# EAGLE design tivaAdapterPcb (EAGLE 9.5.2)
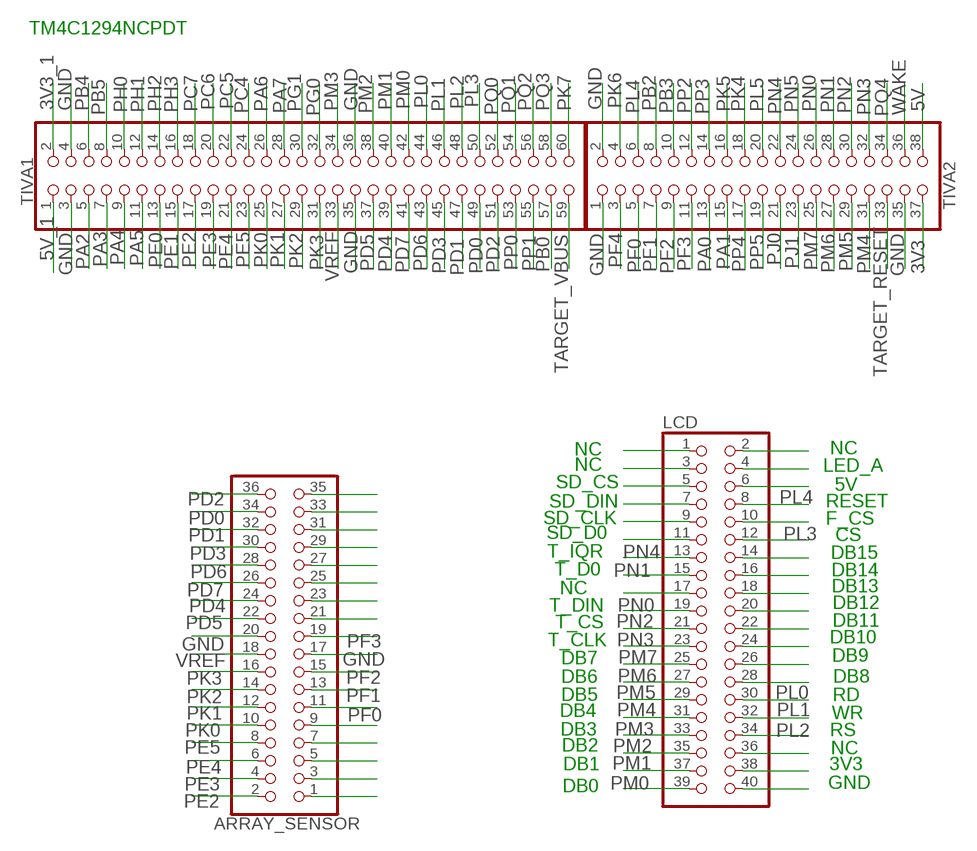
[diagram p0: schematic, sheet 1]

## Parts
ARRAY_SENSOR  PINHD-2X18  [2X18]
LCD  PINHD-2X20  [2X20]
TIVA1  PINHD-2X30  [2X30]
TIVA2  PINHD-2X19  [2X19]

## Nets
3V3: TIVA2.37
3V3_1: TIVA1.2
5V: TIVA2.38
5V_1: TIVA1.1
GND: ARRAY_SENSOR.17 ARRAY_SENSOR.20 TIVA1.3 TIVA1.4 TIVA1.35 TIVA1.36 TIVA2.1 TIVA2.2 TIVA2.35
N$1: ARRAY_SENSOR.1
N$2: LCD.1
N$3: ARRAY_SENSOR.3
N$4: LCD.2
N$5: ARRAY_SENSOR.5
N$6: LCD.3
N$7: ARRAY_SENSOR.7
N$8: LCD.4
N$9: ARRAY_SENSOR.9
N$10: LCD.5
N$11: LCD.6
N$12: LCD.7
N$14: LCD.9
N$15: LCD.10
N$16: LCD.11
N$19: LCD.14
N$21: ARRAY_SENSOR.21
N$22: LCD.16
N$23: ARRAY_SENSOR.23
N$24: LCD.17
N$25: ARRAY_SENSOR.25
N$26: LCD.18
N$27: ARRAY_SENSOR.27
N$29: ARRAY_SENSOR.29
N$30: LCD.20
N$31: ARRAY_SENSOR.31
N$33: ARRAY_SENSOR.33
N$34: LCD.22
N$35: ARRAY_SENSOR.35
N$37: LCD.24
N$39: LCD.26
N$41: LCD.28
N$49: LCD.36
N$51: LCD.38
N$53: LCD.40
PA0: TIVA2.13
PA1: TIVA2.15
PA2: TIVA1.5
PA3: TIVA1.7
PA4: TIVA1.9
PA5: TIVA1.11
PA6: TIVA1.26
PA7: TIVA1.28
PB0: TIVA1.57
PB2: TIVA2.8
PB3: TIVA2.10
PB4: TIVA1.6
PB5: TIVA1.8
PC4: TIVA1.24
PC5: TIVA1.22
PC6: TIVA1.20
PC7: TIVA1.18
PD0: ARRAY_SENSOR.34 TIVA1.49
PD1: ARRAY_SENSOR.32 TIVA1.47
PD2: ARRAY_SENSOR.36 TIVA1.51
PD3: ARRAY_SENSOR.30 TIVA1.45
PD4: ARRAY_SENSOR.24 TIVA1.39
PD5: ARRAY_SENSOR.22 TIVA1.37
PD6: ARRAY_SENSOR.28 TIVA1.43
PD7: ARRAY_SENSOR.26 TIVA1.41
PE0: TIVA1.13
PE1: TIVA1.15
PE2: ARRAY_SENSOR.2 TIVA1.17
PE3: ARRAY_SENSOR.4 TIVA1.19
PE4: ARRAY_SENSOR.6 TIVA1.21
PE5: ARRAY_SENSOR.8 TIVA1.23
PF0: ARRAY_SENSOR.11 TIVA2.5
PF1: ARRAY_SENSOR.13 TIVA2.7
PF2: ARRAY_SENSOR.15 TIVA2.9
PF3: ARRAY_SENSOR.19 TIVA2.11
PF4: TIVA2.3
PG0: TIVA1.32
PG1: TIVA1.30
PH0: TIVA1.10
PH1: TIVA1.12
PH2: TIVA1.14
PH3: TIVA1.16
PJ0: TIVA2.21
PJ1: TIVA2.23
PK0: ARRAY_SENSOR.10 TIVA1.25
PK1: ARRAY_SENSOR.12 TIVA1.27
PK2: ARRAY_SENSOR.14 TIVA1.29
PK3: ARRAY_SENSOR.16 TIVA1.31
PK4: TIVA2.18
PK5: TIVA2.16
PK6: TIVA2.4
PK7: TIVA1.60
PL0: LCD.30 TIVA1.44
PL1: LCD.32 TIVA1.46
PL2: LCD.34 TIVA1.48
PL3: LCD.12 TIVA1.50
PL4: LCD.8 TIVA2.6
PL5: TIVA2.20
PM0: LCD.39 TIVA1.42
PM1: LCD.37 TIVA1.40
PM2: LCD.35 TIVA1.38
PM3: LCD.33 TIVA1.34
PM4: LCD.31 TIVA2.31
PM5: LCD.29 TIVA2.29
PM6: LCD.27 TIVA2.27
PM7: LCD.25 TIVA2.25
PN0: LCD.19 TIVA2.26
PN1: LCD.15 TIVA2.28
PN2: LCD.21 TIVA2.30
PN3: LCD.23 TIVA2.32
PN4: LCD.13 TIVA2.22
PN5: TIVA2.24
PP0: TIVA1.53
PP1: TIVA1.55
PP2: TIVA2.12
PP3: TIVA2.14
PP4: TIVA2.17
PP5: TIVA2.19
PQ0: TIVA1.52
PQ1: TIVA1.54
PQ2: TIVA1.56
PQ3: TIVA1.58
PQ4: TIVA2.34
TARGET_RESET: TIVA2.33
TARGET_VBUS: TIVA1.59
VREF: ARRAY_SENSOR.18 TIVA1.33
WAKE: TIVA2.36

## Notes on the sheet
- TM4C1294NCPDT
- NC | NC
- NC | LED_A
- SD_CS | 5V
- SD_DIN | RESET
- SD_CLK | F_CS
- SD_D0 | CS
- T_IQR | DB15
- T_D0 | DB14
- NC | DB13
- T_DIN | DB12
- T_CS | DB11
- T_CLK | DB10
- DB7 | DB9
- DB6 | DB8
- DB5 | RD
- DB4 | WR
- DB3 | RS
- DB2 | NC
- DB1 | 3V3
- DB0 | GND

## Library data of the parts
ARRAY_SENSOR = pinhead:PINHD-2X18: PIN HEADER
LCD = pinhead:PINHD-2X20: PIN HEADER
TIVA1 = pinhead:PINHD-2X30: PIN HEADER
TIVA2 = pinhead:PINHD-2X19: PIN HEADER

## Board
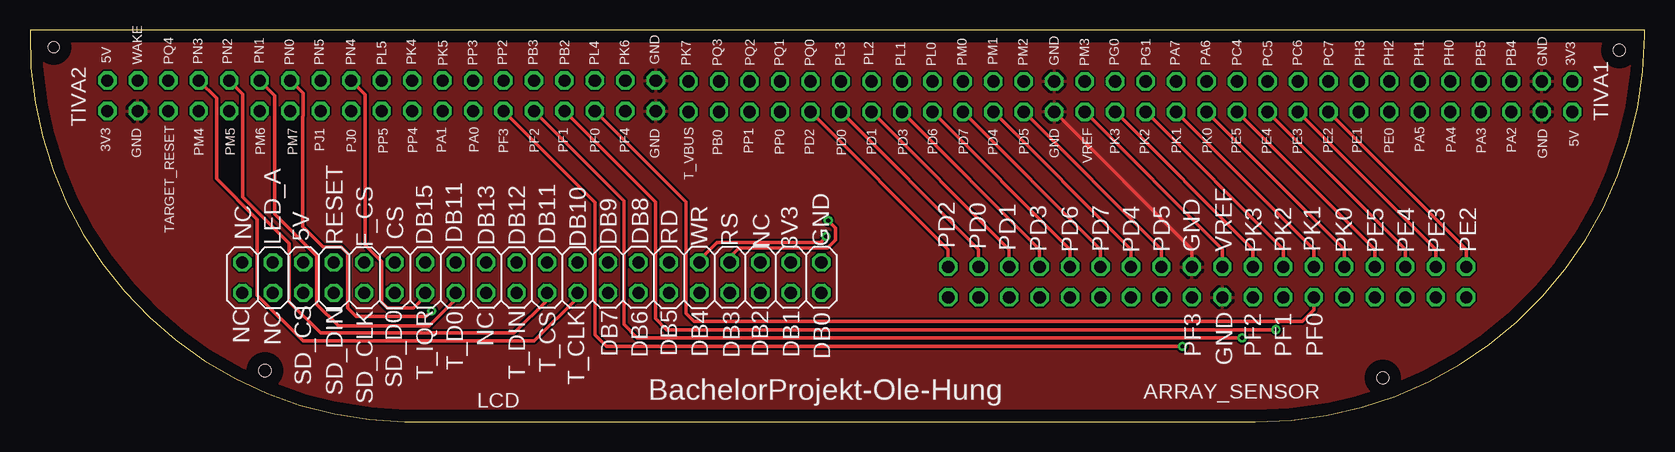
[diagram p1: board, top side]
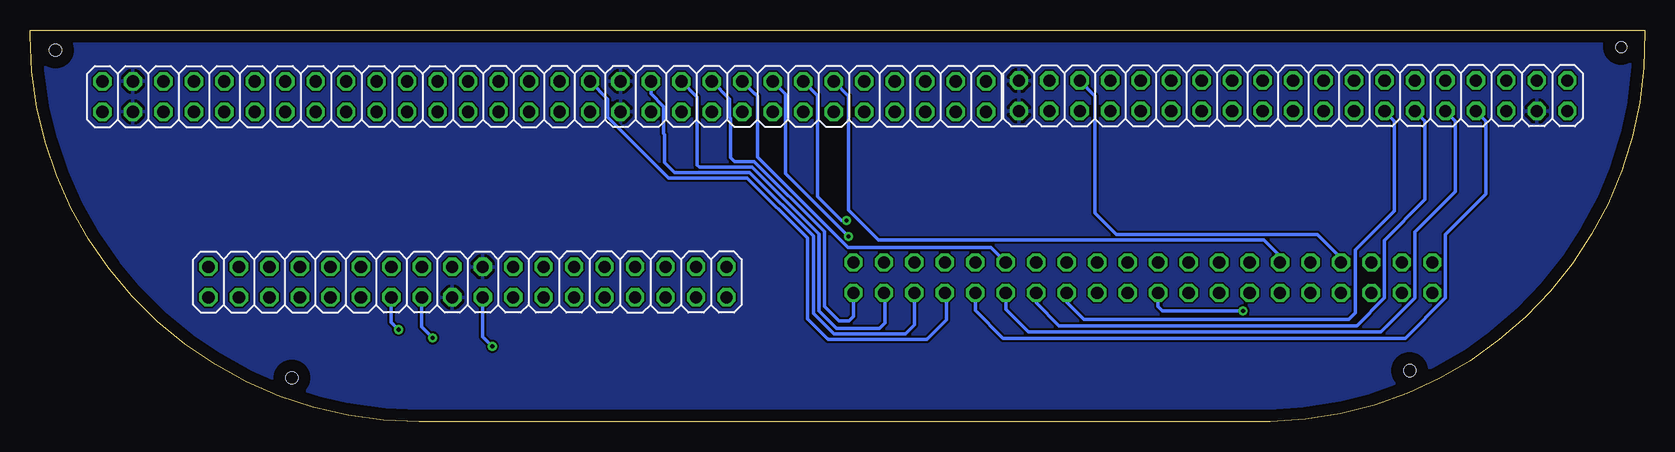
[diagram p2: board, bottom side, seen from below]

Size 134.6 x 32.69 mm. Coordinates in mm from the lower left corner, seen from the top.
Outline: 0,32.69 0,32.49 arc90 31.22,0 102.15,0 arc90 134.6,32.2 134.6,32.69 0,32.69
Copper layers (1*16): Top 0.035mm / dielectric 1.5mm / Bottom 0.035mm
Design rules "default": minimum track width 6mil, minimum drill 0.35mm, track to track 6mil, track to pad 6mil, pad to pad 6mil, via to via 6mil, smd to smd 6mil, copper to edge 40mil, drill to drill 6mil, minimum pad ring 10mil, minimum via ring 8mil, stop-mask expansion 4mil, vias tented up to drill 0mil, thermal gap 10mil
Holes 0.9 mm at 1.97,31.25
Holes 1 mm at 132.48,31 19.59,4.27 112.77,3.67

### Footprints (pad centres in the part's own frame; a part is rotated, then mirrored left to right if it is on the bottom)
2X18 = drill 1.016 octagon: 1 -21.59,-1.27; 2 -21.59,1.27; 3 -19.05,-1.27; 4 -19.05,1.27; 5 -16.51,-1.27; 6 -16.51,1.27; 7 -13.97,-1.27; 8 -13.97,1.27; 9 -11.43,-1.27; 10 -11.43,1.27; 11 -8.89,-1.27; 12 -8.89,1.27; 13 -6.35,-1.27; 14 -6.35,1.27; 15 -3.81,-1.27; 16 -3.81,1.27; 17 -1.27,-1.27; 18 -1.27,1.27; 19 1.27,-1.27; 20 1.27,1.27; 21 3.81,-1.27; 22 3.81,1.27; 23 6.35,-1.27; 24 6.35,1.27; 25 8.89,-1.27; 26 8.89,1.27; 27 11.43,-1.27; 28 11.43,1.27; 29 13.97,-1.27; 30 13.97,1.27; 31 16.51,-1.27; 32 16.51,1.27; 33 19.05,-1.27; 34 19.05,1.27; 35 21.59,-1.27; 36 21.59,1.27
2X20 = drill 1.016 octagon: 1 -24.13,-1.27; 2 -24.13,1.27; 3 -21.59,-1.27; 4 -21.59,1.27; 5 -19.05,-1.27; 6 -19.05,1.27; 7 -16.51,-1.27; 8 -16.51,1.27; 9 -13.97,-1.27; 10 -13.97,1.27; 11 -11.43,-1.27; 12 -11.43,1.27; 13 -8.89,-1.27; 14 -8.89,1.27; 15 -6.35,-1.27; 16 -6.35,1.27; 17 -3.81,-1.27; 18 -3.81,1.27; 19 -1.27,-1.27; 20 -1.27,1.27; 21 1.27,-1.27; 22 1.27,1.27; 23 3.81,-1.27; 24 3.81,1.27; 25 6.35,-1.27; 26 6.35,1.27; 27 8.89,-1.27; 28 8.89,1.27; 29 11.43,-1.27; 30 11.43,1.27; 31 13.97,-1.27; 32 13.97,1.27; 33 16.51,-1.27; 34 16.51,1.27; 35 19.05,-1.27; 36 19.05,1.27; 37 21.59,-1.27; 38 21.59,1.27; 39 24.13,-1.27; 40 24.13,1.27
2X30 = drill 1.016 octagon: 1 -38.1,-1.27; 2 -38.1,1.27; 3 -35.56,-1.27; 4 -35.56,1.27; 5 -33.02,-1.27; 6 -33.02,1.27; 7 -30.48,-1.27; 8 -30.48,1.27; 9 -27.94,-1.27; 10 -27.94,1.27; 11 -25.4,-1.27; 12 -25.4,1.27; 13 -22.86,-1.27; 14 -22.86,1.27; 15 -20.32,-1.27; 16 -20.32,1.27; 17 -17.78,-1.27; 18 -17.78,1.27; 19 -15.24,-1.27; 20 -15.24,1.27; 21 -12.7,-1.27; 22 -12.7,1.27; 23 -10.16,-1.27; 24 -10.16,1.27; 25 -7.62,-1.27; 26 -7.62,1.27; 27 -5.08,-1.27; 28 -5.08,1.27; 29 -2.54,-1.27; 30 -2.54,1.27; 31 0,-1.27; 32 0,1.27; 33 2.54,-1.27; 34 2.54,1.27; 35 5.08,-1.27; 36 5.08,1.27; 37 7.62,-1.27; 38 7.62,1.27; 39 10.16,-1.27; 40 10.16,1.27; 41 12.7,-1.27; 42 12.7,1.27; 43 15.24,-1.27; 44 15.24,1.27; 45 17.78,-1.27; 46 17.78,1.27; 47 20.32,-1.27; 48 20.32,1.27; 49 22.86,-1.27; 50 22.86,1.27; 51 25.4,-1.27; 52 25.4,1.27; 53 27.94,-1.27; 54 27.94,1.27; 55 30.48,-1.27; 56 30.48,1.27; 57 33.02,-1.27; 58 33.02,1.27; 59 35.56,-1.27; 60 35.56,1.27
2X19 = drill 1.016 octagon: 1 -22.86,-1.27; 2 -22.86,1.27; 3 -20.32,-1.27; 4 -20.32,1.27; 5 -17.78,-1.27; 6 -17.78,1.27; 7 -15.24,-1.27; 8 -15.24,1.27; 9 -12.7,-1.27; 10 -12.7,1.27; 11 -10.16,-1.27; 12 -10.16,1.27; 13 -7.62,-1.27; 14 -7.62,1.27; 15 -5.08,-1.27; 16 -5.08,1.27; 17 -2.54,-1.27; 18 -2.54,1.27; 19 0,-1.27; 20 0,1.27; 21 2.54,-1.27; 22 2.54,1.27; 23 5.08,-1.27; 24 5.08,1.27; 25 7.62,-1.27; 26 7.62,1.27; 27 10.16,-1.27; 28 10.16,1.27; 29 12.7,-1.27; 30 12.7,1.27; 31 15.24,-1.27; 32 15.24,1.27; 33 17.78,-1.27; 34 17.78,1.27; 35 20.32,-1.27; 36 20.32,1.27; 37 22.86,-1.27; 38 22.86,1.27

### Placement (x,y rotation side)
ARRAY_SENSOR  98.13,11.66 0 bottom
LCD  41.83,12.03 0 top
TIVA1  90.46,27.13 0 bottom
TIVA2  29.31,27.2 0 bottom

### Tracks (layer width: path | path; a pad name or v marks a point on that pad's centre or on a via)
GND
  Top 0.305: TIVA1.35 96.86,14.38 ARRAY_SENSOR.20
  pour Top: 0.01,32.67 134.72,32.67 arc-90 102,-0.05 31.86,-0.05 arc-90 -0.02,31.83 -0.02,32.65
  pour Bottom: -0.03,32.66 134.63,32.66 134.67,32.62 134.67,32.41 arc-90 102.41,0.15 31.68,0.15 arc-90 -0.04,31.87 -0.04,32.65 0,32.65
PD0
  Top 0.305: TIVA1.49 79.08,14.38 ARRAY_SENSOR.34
PD1
  Top 0.305: TIVA1.47 81.62,14.38 ARRAY_SENSOR.32
PD2
  Top 0.305: TIVA1.51 76.54,14.38 ARRAY_SENSOR.36
PD3
  Top 0.305: TIVA1.45 84.16,14.38 ARRAY_SENSOR.30
PD4
  Top 0.305: TIVA1.39 91.78,14.38 ARRAY_SENSOR.24
PD5
  Top 0.305: TIVA1.37 94.32,14.38 ARRAY_SENSOR.22
PD6
  Top 0.305: TIVA1.43 86.7,14.38 ARRAY_SENSOR.28
PD7
  Top 0.305: TIVA1.41 89.24,14.38 ARRAY_SENSOR.26
PE2
  Top 0.305: TIVA1.17 119.72,14.38 ARRAY_SENSOR.2
PE3
  Top 0.305: TIVA1.19 117.18,14.38 ARRAY_SENSOR.4
PE4
  Top 0.305: TIVA1.21 114.64,14.38 ARRAY_SENSOR.6
PE5
  Top 0.305: TIVA1.23 112.1,14.38 ARRAY_SENSOR.8
PF0
  Top 0.305: TIVA2.5 54.7,18.32 54.7,9.05 55.36,8.39 106.07,8.39 107.02,9.34 ARRAY_SENSOR.11
PF1  (via drill 0.35)
  Top 0.305: TIVA2.7 52.15,18.33 52.15,8.62 53.08,7.69 v103.87,7.69
  Bottom 0.305: v103.87,7.69 104.48,8.3 ARRAY_SENSOR.13
PF2  (via drill 0.35)
  Top 0.305: TIVA2.9 49.52,18.42 49.52,8.11 50.62,7.01 v101.04,7.01
  Bottom 0.305: v101.04,7.01 101.94,7.91 ARRAY_SENSOR.15
PF3  (via drill 0.35)
  Top 0.305: TIVA2.11 47.1,18.3 47.1,7.24 48.05,6.29 v96.06,6.29
  Bottom 0.305: v96.06,6.29 96.86,7.09 ARRAY_SENSOR.19
PK0
  Top 0.305: TIVA1.25 109.56,14.38 ARRAY_SENSOR.10
PK1
  Top 0.305: TIVA1.27 107.02,14.38 ARRAY_SENSOR.12
PK2
  Top 0.305: TIVA1.29 104.48,14.38 ARRAY_SENSOR.14
PK3
  Top 0.305: TIVA1.31 101.94,14.38 ARRAY_SENSOR.16
PL0
  Bottom 0.305: TIVA1.44 74.19,27.37 74.15,27.37 73.95,27.17 73.95,22.08 66.42,14.55 54.51,14.55 LCD.30
PL1  (via drill 0.35)
  Top 0.305: v66.37,15.46 65.89,14.98 57.27,14.98 55.8,13.51 LCD.32
  Bottom 0.305: TIVA1.46 71.61,27.33 71.61,20.7 v66.37,15.46
PL2  (via drill 0.35)
  Top 0.305: v66.54,16.79 67.14,16.19 67.14,15.18 66.48,14.52 59.12,14.52 58.34,13.74 LCD.34
  Bottom 0.305: TIVA1.48 68.97,27.23 68.97,18.79 66.97,16.79 v66.54,16.79
PL3
  Bottom 0.305: TIVA1.50 66.38,27.18 66.38,17.68 63.86,15.16 31.73,15.16 30.4,13.83 LCD.12
PL4
  Bottom 0.305: TIVA2.6 45.81,27.19 45.81,17.4 44.05,15.64 27.3,15.64 25.32,13.66 LCD.8
PM0
  Bottom 0.305: TIVA1.42 76.29,26.93 76.29,25.42 76.19,25.32 76.19,22.05 75.86,21.72 74.24,21.72 68.39,15.87 68.39,9.64 67.16,8.41 66.34,8.41 65.96,8.79 LCD.39
PM1
  Bottom 0.305: TIVA1.40 78.98,27.08 78.98,21.44 78.8,21.26 74.43,21.26 68.84,15.68 68.84,9.26 67.37,7.78 63.79,7.78 63.31,8.26 63.31,10.65 LCD.37
PM2
  Bottom 0.305: TIVA1.38 82.84,27.37 81.77,26.3 81.77,24.03 81.7,23.96 81.7,21.64 80.87,20.81 74.62,20.81 69.3,15.49 69.3,9.05 67.58,7.33 61.61,7.33 60.86,8.08 60.86,10.74 LCD.35
PM3
  Bottom 0.305: TIVA1.34 86.45,26.93 86.45,25.42 81.38,20.35 74.81,20.35 69.78,15.32 69.78,8.58 68.07,6.87 59.84,6.87 58.21,8.5 58.21,10.63 LCD.33
PM4
  Bottom 0.305: TIVA2.31 13.24,25.1 13.24,19.02 16.63,15.63 16.63,10.32 19.97,6.98 53.48,6.98 55.8,9.3 LCD.31
PM5
  Bottom 0.305: TIVA2.29 15.78,25.1 15.78,19.22 19.17,15.83 19.17,10.32 21.98,7.51 51.39,7.51 53.26,9.38 LCD.29
PM6
  Bottom 0.305: TIVA2.27 18.32,25.1 18.32,18.53 21.71,15.14 21.71,10.32 24.01,8.02 48.81,8.02 50.72,9.93 LCD.27
PM7
  Bottom 0.305: TIVA2.25 20.86,25.1 20.86,17.59 24.12,14.33 24.12,9.08 24.67,8.53 46.76,8.53 48.18,9.95 LCD.25
PN0  (via drill 0.35)
  Top 0.305: TIVA2.26 22.76,27.4 22.76,25.49 22.71,25.44 22.71,16.3 24.42,14.59 25.94,14.59 26.49,14.04 26.49,9.51 27.2,8.8 33.02,8.8 v33.48,9.26
  Bottom 0.305: v33.48,9.26 40.2,9.26 40.57,9.63 LCD.19
PN1
  Top 0.305: TIVA2.28 20.41,27.21 20.41,17.33 23.02,14.72 23.04,14.72 23.91,13.85 23.91,9.81 25.71,8.01 33.29,8.01 35.48,10.2 LCD.15
PN2
  Top 0.305: TIVA2.30 17.73,27.35 17.73,18.74 21.43,15.04 21.46,15.04 21.62,14.88 21.62,10.02 24.24,7.4 40.36,7.4 43.1,10.14 LCD.21
PN3
  Top 0.305: TIVA2.32 15.54,27 15.54,20.28 18.93,16.9 18.93,10.56 22.75,6.74 42.04,6.74 45.64,10.34 LCD.23
PN4
  Top 0.305: TIVA2.22 27.95,27.29 27.95,14.74 29.32,13.37 29.32,9.95 29.76,9.51 31.97,9.51 32.94,10.48 LCD.13
VREF
  Top 0.305: TIVA1.33 99.4,14.38 ARRAY_SENSOR.18

### Text on the board
tPlace: 5V | WAKE | PQ4 | PN3 | PN2 | PN1 | PN0 | PN5 | PN4 | PL5 | PK4 | PP2 | PB3 | PB2 | PL4 | PK6 | GND | PL2 | PM1 | PK5 | PP3 | PK7 | PQ3 | PQ2 | PQ1 | PQ0 | PL3 | PL1 | PL0 | PM0 | PM2 | GND | PM3 | PG0 | PG1 | PA7 | PA6 | PC4 | PC5 | PC6 | PC7 | PH3 | PH2 | PH1 | PH0 | PB5 | PB4 | GND | 3V3 | 5V | 3V3 | GND | PM4 | PM5 | PM6 | PM7 | PJ1 | PJ0 | PP5 | PP4 | PA1 | PA0 | PF3 | PF2 | PF1 | PF0 | PF4 | GND | PB0 | PP1 | PP0 | PD2 | PD0 | PD1 | PD3 | PD6 | PD7 | PD4 | PD5 | GND | PK3 | PK2 | PK1 | PK0 | PE5 | PE4 | PE3 | PE2 | PE1 | PE0 | PA5 | PA4 | PA3 | PA2 | GND | VREF | T_VBUS | TARGET_RESET | NC | LED_A | 5V | RESET | CS | DB15 | DB11 | DB11 | DB9 | DB8 | RD | F_CS | DB13 | DB12 | DB10 | WR | RS | NC | 3V3 | GND | PD2 | PD0 | PD1 | PD3 | PD6 | PD7 | PD4 | PD5 | GND | VREF | PK3 | PK2 | PK1 | PK0 | PE5 | PE4 | PE3 | PE2 | NC | NC | NC | DB7 | DB6 | DB5 | DB4 | DB3 | DB2 | DB1 | DB0 | PF3 | PF2 | PF1 | PF0 | T_D0 | T_CS | GND | SD_CS | SD_D0 | T_IQR | T_DIN | T_CLK | BachelorProjekt-Ole-Hung | SD_DIN | SD_CLK